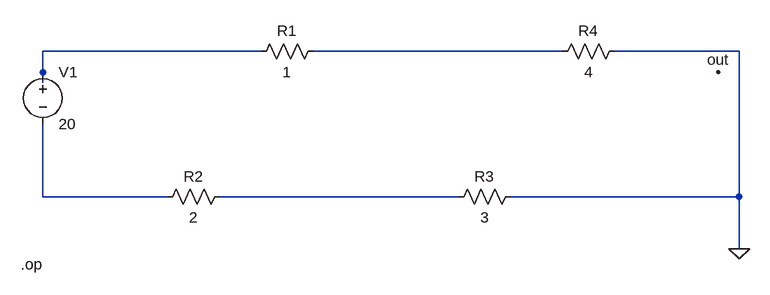
[diagram p0: schematic LtSpice_domaci_1.asc]
LtSpice_domaci_1.asc, the LTspice schematic file:
Version 4
SHEET 1 884 680
WIRE 128 96 -208 96
WIRE 592 96 208 96
WIRE 864 96 672 96
WIRE -208 128 -208 96
WIRE -208 144 -208 128
WIRE -208 320 -208 208
WIRE -16 320 -208 320
WIRE 432 320 64 320
WIRE 864 320 864 96
WIRE 864 320 512 320
WIRE 864 400 864 320
FLAG 864 400 0
FLAG 832 128 out
SYMBOL res 224 80 R90
WINDOW 0 0 56 VBottom 2
WINDOW 3 32 56 VTop 2
SYMATTR InstName R1
SYMATTR Value 1
SYMBOL res 80 304 R90
WINDOW 0 0 56 VBottom 2
WINDOW 3 32 56 VTop 2
SYMATTR InstName R2
SYMATTR Value 2
SYMBOL res 528 304 R90
WINDOW 0 0 56 VBottom 2
WINDOW 3 32 56 VTop 2
SYMATTR InstName R3
SYMATTR Value 3
SYMBOL res 688 80 R90
WINDOW 0 0 56 VBottom 2
WINDOW 3 32 56 VTop 2
SYMATTR InstName R4
SYMATTR Value 4
SYMBOL voltage -208 112 R0
WINDOW 123 0 0 Left 2
WINDOW 39 0 0 Left 2
SYMATTR InstName V1
SYMATTR Value 20
TEXT -242 424 Left 2 !.op

The netlist it stands for:
* LtSpice_domaci_1.asc
R1 N002 N001 1
R2 N004 N003 2
R3 0 N004 3
R4 0 N002 4
V1 N001 N003 20
.op
.backanno
.end